# Altium schematic sheet Nucleo.SchDoc: Mikrokontroller összekötései
size A4; Author: Király Krisztina; Organization: BME-AUT; DocumentNumber: 3; Revision: 17; SheetNumber: 3; SheetTotal: 4
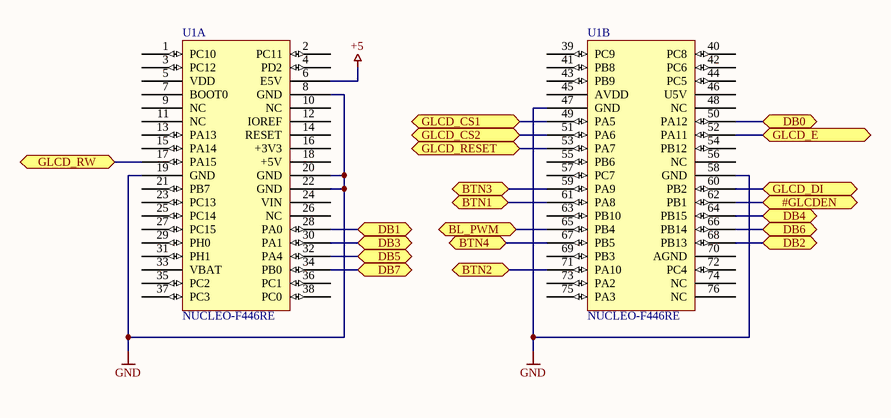
[diagram p0: Nucleo.SchDoc]

## Parts
U1  NUCLEO-F446RE  [FP_NUCLEO-64_2x20]  (parts A,B of 2)

## Ports
#GLCDEN (bidir), BL_PWM (bidir), BTN1 (bidir), BTN2 (bidir), BTN3 (bidir), BTN4 (bidir), DB0 (bidir), DB1 (bidir), DB2 (bidir), DB3 (bidir), DB4 (bidir), DB5 (bidir), DB6 (bidir), DB7 (bidir), GLCD_CS1 (bidir), GLCD_CS2 (bidir), GLCD_DI (bidir), GLCD_E (bidir), GLCD_RESET (bidir), GLCD_RW (bidir)

## Nets
+5: U1.6(E5V)
GND: U1.8(GND) U1.19(GND) U1.20(GND) U1.22(GND) U1.47(GND) U1.58(GND)
#GLCDEN: U1.62(PB1) ; port #GLCDEN
BL_PWM: U1.65(PB4) ; port BL_PWM
BTN1: U1.61(PA8) ; port BTN1
BTN2: U1.71(PA10) ; port BTN2
BTN3: U1.59(PA9) ; port BTN3
BTN4: U1.67(PB5) ; port BTN4
DB0: U1.50(PA12) ; port DB0
DB1: U1.28(PA0) ; port DB1
DB2: U1.68(PB13) ; port DB2
DB3: U1.30(PA1) ; port DB3
DB4: U1.64(PB15) ; port DB4
DB5: U1.32(PA4) ; port DB5
DB6: U1.66(PB14) ; port DB6
DB7: U1.34(PB0) ; port DB7
GLCD_CS1: U1.49(PA5) ; port GLCD_CS1
GLCD_CS2: U1.51(PA6) ; port GLCD_CS2
GLCD_DI: U1.60(PB2) ; port GLCD_DI
GLCD_E: U1.52(PA11) ; port GLCD_E
GLCD_RESET: U1.53(PA7) ; port GLCD_RESET
GLCD_RW: U1.17(PA15) ; port GLCD_RW

Not connected (* = marked no-connect by the designer): U1 1(PC10) 2(PC11) 3(PC12) 4(PD2) 5(VDD) 7(BOOT0) 9(NC) 10(NC) 11(NC) 12(IOREF) 13(PA13) 14(RESET) 15(PA14) 16(+3V3) 18(+5V) 21(PB7) 23(PC13) 24(VIN) 25(PC14) 26(NC) 27(PC15) 29(PH0) 31(PH1) 33(VBAT) 35(PC2) 36(PC1) 37(PC3) 38(PC0) 39(PC9) 40(PC8) 41(PB8) 42(PC6) 43(PB9) 44(PC5) 45(AVDD) 46(U5V) 48(NC) 54(PB12) 55(PB6) 56(NC) 57(PC7) 63(PB10) 69(PB3) 70(AGND) 72(PC4) 73(PA2) 74(NC) 75(PA3) 76(NC)

## Notes on the sheet
- Title
- Size:
- Date:
- A4
- Number:
- Time:
- Revision:
- Sheet
- of
- File:

## Library data of the parts
U1 = NUCLEO-F446RE: Reference: NUCLEO; Name: Nucleo F446RE; Supplier: Tanszék